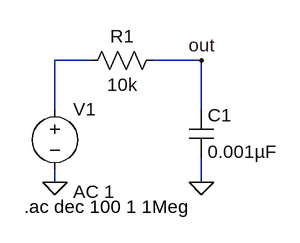
[diagram p0: schematic RCLowPassFilter.asc]
RCLowPassFilter.asc, the LTspice schematic file:
Version 4.1
SHEET 1 880 680
WIRE 128 96 80 96
WIRE 272 96 208 96
WIRE 80 160 80 96
WIRE 272 160 272 96
WIRE 80 256 80 240
WIRE 272 256 272 224
FLAG 272 256 0
FLAG 80 256 0
FLAG 272 96 out
SYMBOL res 224 80 R90
WINDOW 0 0 56 VBottom 2
WINDOW 3 32 56 VTop 2
SYMATTR InstName R1
SYMATTR Value 10k
SYMBOL cap 256 160 R0
SYMATTR InstName C1
SYMATTR Value 0.001µF
SYMBOL voltage 80 144 R0
WINDOW 123 24 124 Left 2
WINDOW 39 0 0 Left 0
SYMATTR InstName V1
SYMATTR Value ""
SYMATTR Value2 AC 1
TEXT 40 288 Left 2 !.ac dec 100 1 1Meg

The netlist it stands for:
* RCLowPassFilter.asc
R1 out N001 10k
C1 out 0 0.001µF
V1 N001 0 AC 1
.ac dec 100 1 1Meg
.backanno
.end